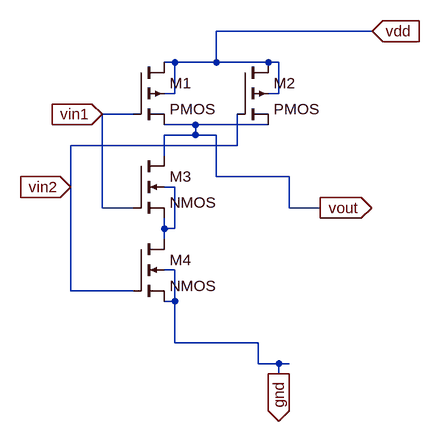
[diagram p0: schematic nandd.asc]
nandd.asc, the LTspice schematic file:
Version 4.1
SHEET 1 880 680
WIRE 544 0 304 0
WIRE 240 48 224 48
WIRE 304 48 304 0
WIRE 304 48 240 48
WIRE 384 48 304 48
WIRE 400 48 384 48
WIRE 240 96 240 48
WIRE 240 96 224 96
WIRE 400 96 400 48
WIRE 400 96 384 96
WIRE 176 128 128 128
WIRE 272 144 224 144
WIRE 384 144 272 144
WIRE 272 160 272 144
WIRE 272 160 224 160
WIRE 304 160 272 160
WIRE 336 176 336 128
WIRE 336 176 80 176
WIRE 224 192 224 160
WIRE 304 224 304 160
WIRE 416 224 304 224
WIRE 80 240 80 176
WIRE 240 240 224 240
WIRE 128 272 128 128
WIRE 176 272 128 272
WIRE 416 272 416 224
WIRE 464 272 416 272
WIRE 224 304 224 288
WIRE 240 304 240 240
WIRE 240 304 224 304
WIRE 224 320 224 304
WIRE 240 368 224 368
WIRE 80 400 80 240
WIRE 176 400 80 400
WIRE 240 416 240 368
WIRE 240 416 224 416
WIRE 240 480 240 416
WIRE 368 480 240 480
WIRE 368 512 368 480
WIRE 400 512 368 512
WIRE 416 512 400 512
WIRE 400 528 400 512
FLAG 464 272 vout
IOPIN 464 272 Out
FLAG 128 128 vin1
IOPIN 128 128 In
FLAG 80 240 vin2
IOPIN 80 240 In
FLAG 544 0 vdd
IOPIN 544 0 In
FLAG 400 528 gnd
IOPIN 400 528 Out
SYMBOL pmos4 176 48 R0
SYMATTR InstName M1
SYMATTR Value2 l=180n w=810n
SYMBOL pmos4 336 48 R0
SYMATTR InstName M2
SYMATTR Value2 l=180n w=810n
SYMBOL nmos4 176 192 R0
SYMATTR InstName M3
SYMATTR Value2 l=180n w=270n
SYMBOL nmos4 176 320 R0
SYMATTR InstName M4
SYMATTR Value2 l=180n w=270n

The netlist it stands for:
* nandd.asc
M1 vdd vin1 vout vdd PMOS l=180n w=810n
M2 vdd vin2 vout vdd PMOS l=180n w=810n
M3 vout vin1 N001 N001 NMOS l=180n w=270n
M4 N001 vin2 gnd gnd NMOS l=180n w=270n
.model NMOS NMOS
.model PMOS PMOS
.lib standard.mos
.backanno
.end